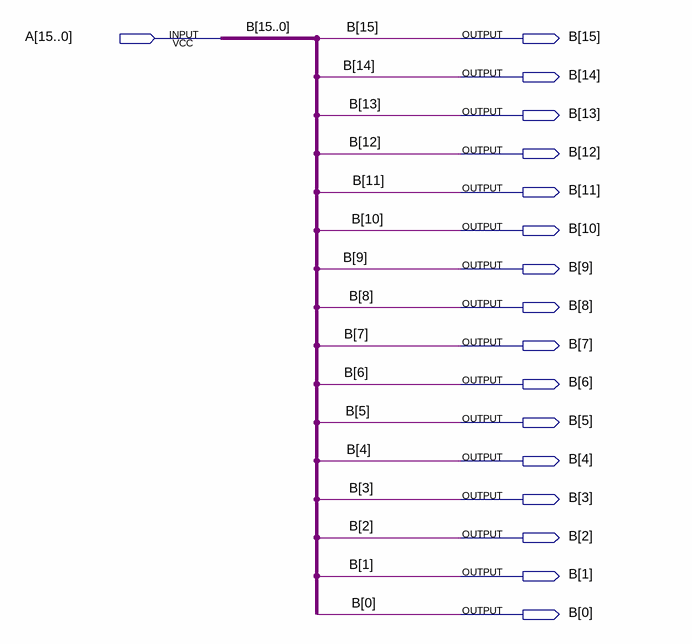
[diagram p0: schematic sheet]
// Quartus schematic bus16.bdf as structural Verilog: 0 symbols, 17 pins
module bus16 (
  input  [15:0] A,
  output [15:0] B
);


  assign B = A;
endmodule
